# EAGLE design USBHost (EAGLE 6.5.0)
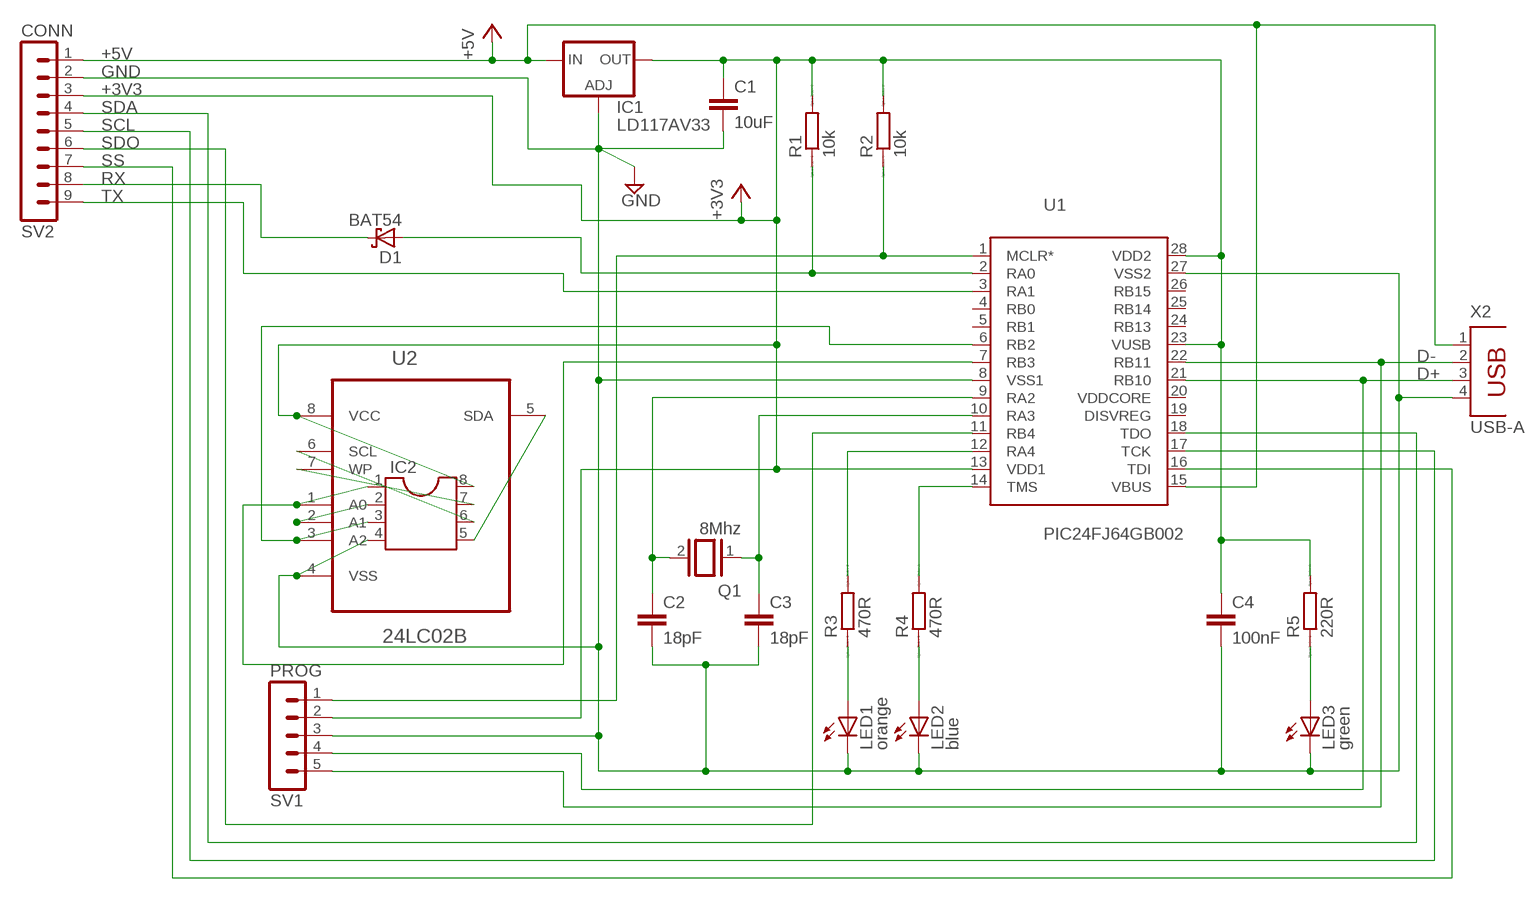
[diagram p0: schematic, sheet 1]

## Parts
C1  10uF  C-EU025-025X050  [C025-025X050]
C2  18pF  C-EU025-025X050  [C025-025X050]
C3  18pF  C-EU025-025X050  [C025-025X050]
C4  100nF  C-EU025-025X050  [C025-025X050]
D1  BAT54  SCHOTTKY-DIODEDO35-7  [DO35-7]
IC1  LD117AV33  [TO220L1]
IC2  DIL8S  [SOCKET-08]
LED1  orange  LED5MM  [LED5MM]
LED2  blue  LED5MM  [LED5MM]
LED3  green  LED5MM  [LED5MM]
Q1  8Mhz  XTAL/S  [QS]
R1  10k  R0204/7  [0204/7]
R2  10k  R0204/7  [0204/7]
R3  470R  R0204/7  [0204/7]
R4  470R  R0204/7  [0204/7]
R5  220R  R0204/7  [0204/7]
SV1  PROG  MA05-1  [MA05-1]
SV2  CONN  MA09-1  [MA09-1]
U1  PIC24FJ64GB002  PIC24FJ64GB002-I/SP  [DIP254P762X508-28]
U2  24LC02B  24LC02B-I/SN  [SOIC127P600X175-8N]
X2  USB-A  PN87520  [PN87520]

## Nets
+3V3: C1.1 C4.1 IC1.2(OUT) IC2.8 R1.2 R2.2 R5.2 SV1.2 SV2.3 U1.13(VDD1) U1.23(VUSB) U1.28(VDD2) U2.8(VCC)
+5V: IC1.3(IN) SV2.1 U1.15(VBUS) X2.1
D+: SV1.4 U1.21(RB10) X2.3
D-: SV1.5 U1.22(RB11) X2.2
GND: C1.2 C2.2 C3.2 C4.2 IC1.1(ADJ) IC2.4 LED1.K(C) LED2.K(C) LED3.K(C) SV1.3 SV2.2 U1.8(VSS1) U1.27(VSS2) U2.4(VSS) X2.4
N$1: C3.1 Q1.1 U1.10(RA3)
N$2: C2.1 Q1.2 U1.9(RA2)
N$4: LED3.A R5.1
N$5: R2.1 SV1.1 U1.1(MCLR*)
N$6: LED2.A R4.1
N$7: LED1.A R3.1
N$8: R4.2 U1.14(TMS)
N$9: R3.2 U1.12(RA4)
N$10: D1.A R1.1 U1.2(RA0)
N$11: IC2.2 U2.2(A1)
N$12: IC2.3 U1.6(RB2) U2.3(A2)
N$13: IC2.1 U1.7(RB3) U2.1(A0)
N$14: IC2.5 U2.5(SDA)
N$15: IC2.6 U2.6(SCL)
N$16: IC2.7 U2.7(WP)
RX: D1.C SV2.8
SCL: SV2.5 U1.17(TCK)
SDA: SV2.4 U1.18(TDO)
SDO: SV2.6 U1.11(RB4)
SS: SV2.7 U1.16(TDI)
TX: SV2.9 U1.3(RA1)
Unconnected: U1.4(RB0) U1.5(RB1) U1.19(DISVREG) U1.24(RB13) U1.25(RB14) U1.26(RB15)

## Power pins joined to a net without a drawn wire
VDDCORE: U1.20(VDDCORE)

## Library data of the parts
C1-C4 = resistor:C-EU: CAPACITOR, European symbol
D1 = diode:SCHOTTKY-DIODE: Schottky Diode
IC1 = v-reg:LD117A?*: Low drop fixed and adjustable positive voltage regulators 1 A Source: http://www.st.com/stonline/products/literature/ds/7194/ld1117axx.pdf
IC2 = ic-package:DIL8: Dual In Line / Socket
LED1-LED3 = led:LED: LED OSRAM: - CHIPLED LG R971, LG N971, LY N971, LG Q971, LY Q971, LO R971, LY R971 LH N974, LH R974 LS Q976, LO Q976, LY Q976 LO Q996 - Hyper CHIPLED LW Q18S LB Q993, LB Q99A, LB R99A - SideLED LS A670, LO A670, LY A670, LG A670, LP A670 LB A673, LV A673, LT A673, LW A673 LH A674 LY A675 LS A676, LA A676, LO A676, LY A676, LW A676 LS A679, LY A679, LG A679 - Hyper Micro SIDELED® LS Y876, LA Y876, LO Y876, LY Y876 LT Y87S - SmartLED LW L88C, LW L88S LB L89C, LB L89S, LG L890 LS L89K, LO L89K, LY L89K LS L896, LA L896, LO L896, LY L896 - TOPLED LS T670, LO T670, LY T670, LG T670, LP T670 LSG T670, LSP T670, LSY T670, LOP T670, LYG T670 LG T671, LOG T671, LSG T671 LB T673, LV T673, LT T673, LW T673 LH T674 LS T676, LA T676, LO T676, LY T676, LB T676, LH T676, LSB T676, LW T676 LB T67C, LV T67C, LT T67C, LS T67K, LO T67K, LY T67K, LW E67C LS E67B, LA E67B, LO E67B, LY E67B, LB E67C, LV E67C, LT E67C LW T67C LS T679, LY T679, LG T679 LS T770, LO T770, LY T770, LG T770, LP T770 LB T773, LV T773, LT T773, LW T773 LH T774 LS E675, LA E675, LY E675, LS T675 LS T776, LA T776, LO T776, LY T776, LB T776 LHGB T686 LT T68C, LB T68C - Hyper Mini TOPLED® LB M676 - Mini TOPLED Santana® LG M470 LS M47K, LO M47K, LY M47K Source: http://www.osram.convergy.de LUXEON: - LUMILED® LXK2-PW12-R00, LXK2-PW12-S00, LXK2-PW14-U00, LXK2-PW14-V00 LXK2-PM12-R00, LXK2-PM12-S00, LXK2-PM14-U00 LXK2-PE12-Q00, LXK2-PE12-R00, LXK2-PE12-S00, LXK2-PE14-T00, LXK2-PE14-U00 LXK2-PB12-K00, LXK2-PB12-L00, LXK2-PB12-M00, LXK2-PB14-N00, LXK2-PB14-P00, LXK2-PB14-Q00 LXK2-PR12-L00, LXK2-PR12-M00, LXK2-PR14-Q00, LXK2-PR14-R00 LXK2-PD12-Q00, LXK2-PD12-R00, LXK2-PD12-S00 LXK2-PH12-R00, LXK2-PH12-S00 LXK2-PL12-P00, LXK2-PL12-Q00, LXK2-PL12-R00 Source: www.luxeon.com KINGBRIGHT: KA-3528ASYC Source: www.kingbright.com
Q1 = special:XTAL/S: CRYSTAL
R1-R5 = eagle-ltspice:R: RESISTOR, European symbol; SPICEMODEL: NONE; SPICEPREFIX: R
SV1 = con-lstb:MA05-1: PIN HEADER; OC_FARNELL: unknown; OC_NEWARK: unknown
SV2 = con-lstb:MA09-1: PIN HEADER; OC_FARNELL: unknown; OC_NEWARK: unknown
U1 = Microchip-PIC24:PIC24FJ64GB002-I/SP: IC MCU 16BIT 64KB FLASH,SDIP-28; MPN: PIC24FJ64GB002-I/SP; OC_FARNELL: 07P9739; OC_NEWARK: 1778485; PACKAGE: DIP-28; SUPPLIER: Microchip
U2 = Microchip-24LCxxx:24LC: IC, I2C™ Serial EEPROM; MPN: 24LC02B-I/SNG; OC_FARNELL: 1818516; OC_NEWARK: 30H1482; PACKAGE: SOIC-8; SUPPLIER: MICROCHIP
X2 = con-berg_2:PN87520: BERG USB connector; OC_FARNELL: unknown; OC_NEWARK: unknown

## Net classes
0 default: clearance 0.205 mm

## Board
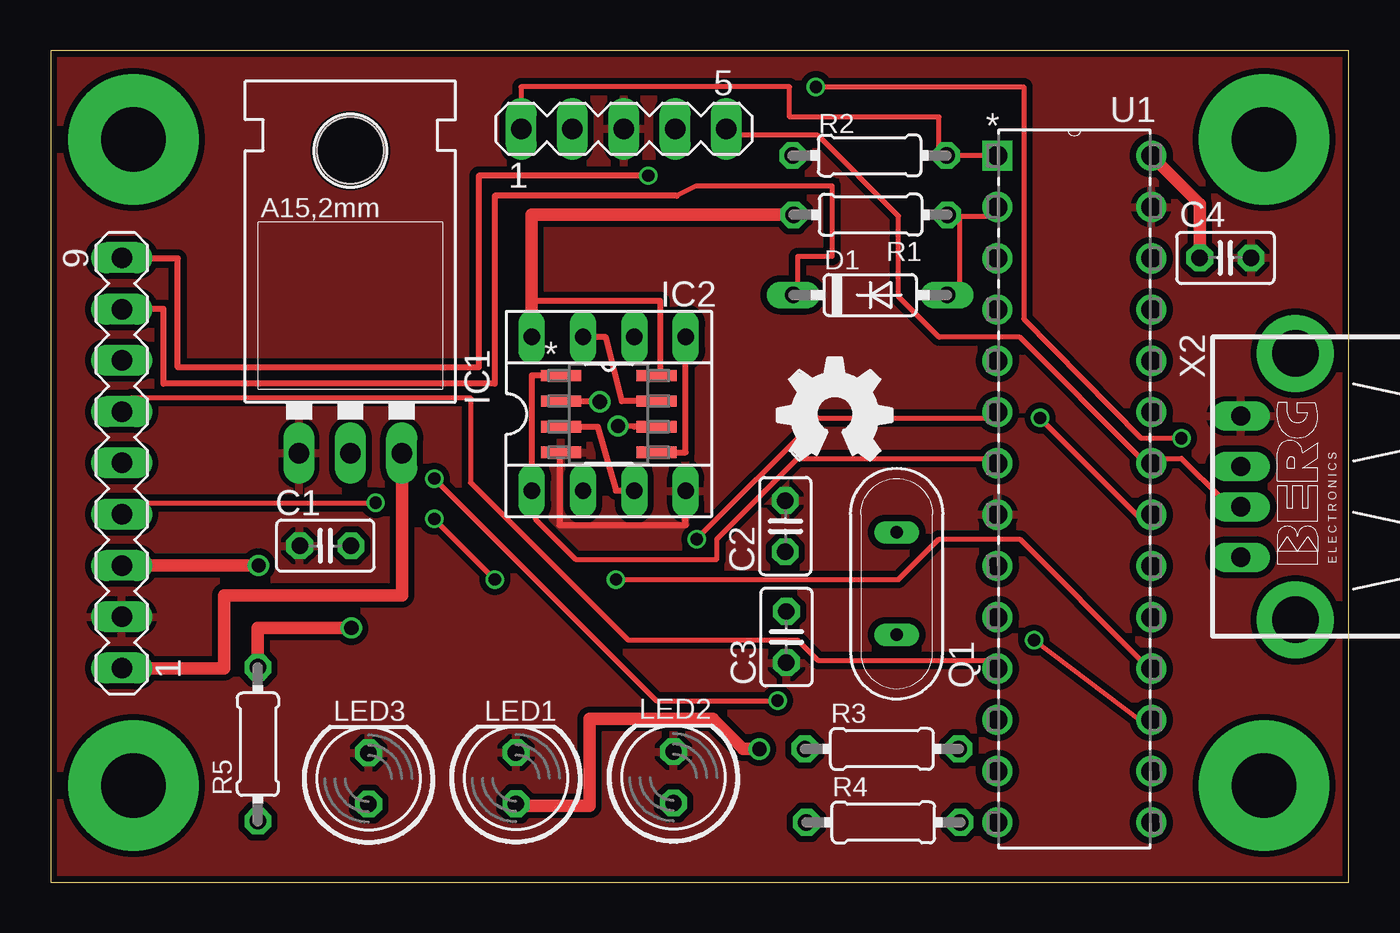
[diagram p1: board, top side]
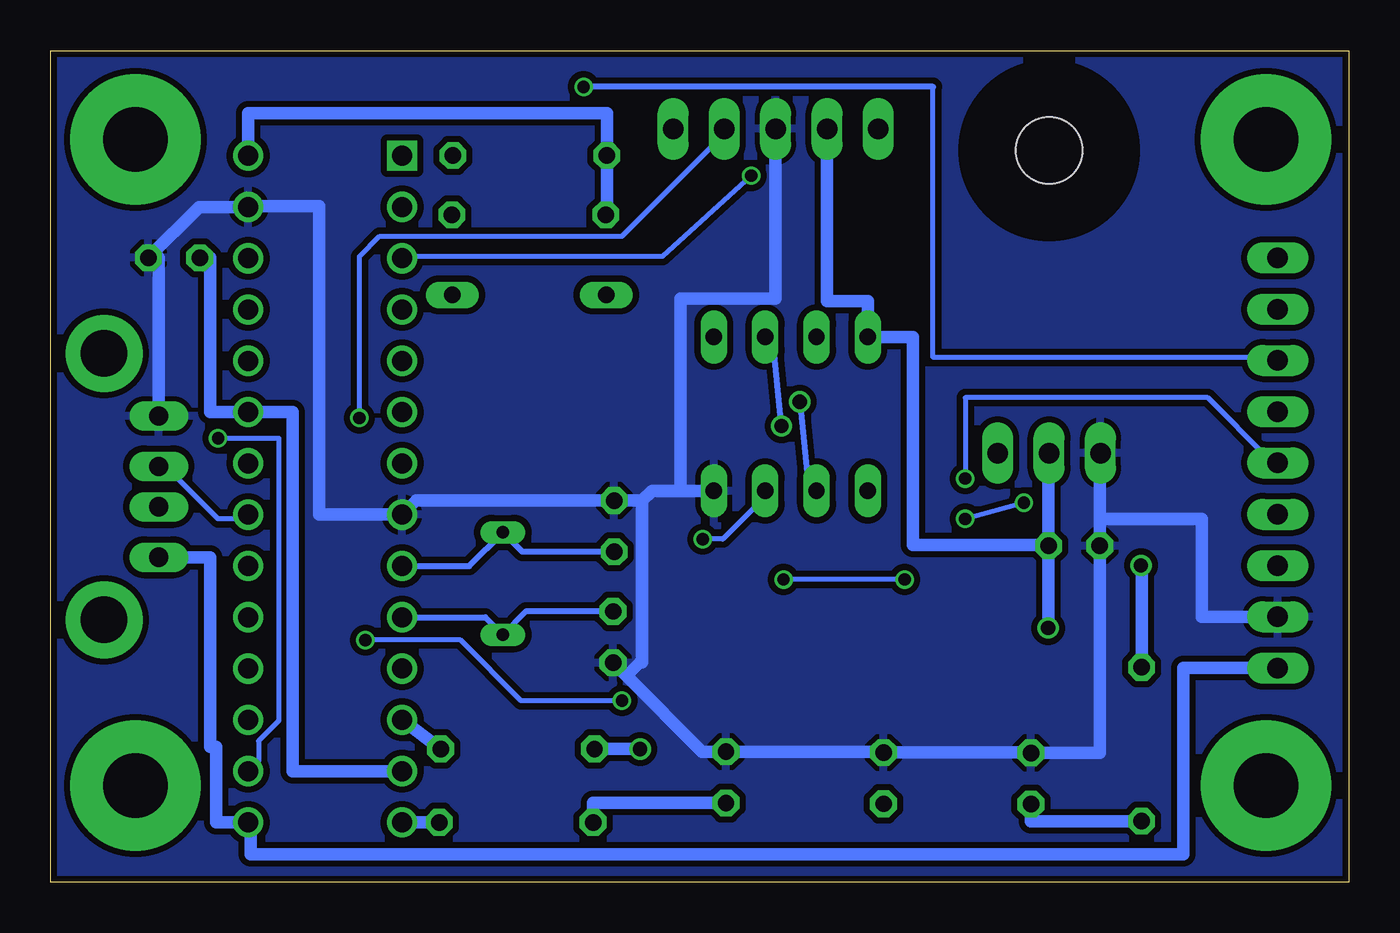
[diagram p2: board, bottom side, seen from below]

Size 64.3 x 41.2 mm. Coordinates in mm from the lower left corner, seen from the top.
Outline: 0,0 64.3,0 64.3,41.2 0,41.2 0,0
Copper layers (1*16): Top 0.035mm / dielectric 1.5mm / Bottom 0.035mm
Design rules "ITEADstudio_DRC": minimum track width 6mil, minimum drill 12mil, track to track 6mil, track to pad 6mil, pad to pad 6mil, via to via 6mil, smd to smd 0mil, copper to edge 10mil, drill to drill 10mil, minimum pad ring 10mil, minimum via ring 6mil, stop-mask expansion 2mil, vias tented up to drill 100mil, thermal gap 10mil

### Footprints (pad centres in the part's own frame; a part is rotated, then mirrored left to right if it is on the bottom)
C025-025X050 = drill 0.813 octagon: 1 -1.27,0; 2 1.27,0
DO35-7 = drill 0.813 long: A 3.81,0; C -3.81,0
TO220L1 = drill 1.016 long: 1 -2.54,-3.81; 2 0,-3.81; 3 2.54,-3.81 | hole 3.302: 0,11.176
SOCKET-08 = drill 0.813 long: 1 -3.81,-3.81; 2 -1.27,-3.81; 3 1.27,-3.81; 4 3.81,-3.81; 5 3.81,3.81; 6 1.27,3.81; 7 -1.27,3.81; 8 -3.81,3.81
LED5MM = drill 0.813 octagon: A -1.27,0; K 1.27,0
QS = drill 0.61 long: 1 -2.54,0; 2 2.54,0
0204/7 = drill 0.813 octagon: 1 -3.81,0; 2 3.81,0
MA05-1 = drill 1.016 long: 1 -5.08,0; 2 -2.54,0; 3 0,0; 4 2.54,0; 5 5.08,0
MA09-1 = drill 1.016 long: 1 -10.16,0; 2 -7.62,0; 3 -5.08,0; 4 -2.54,0; 5 0,0; 6 2.54,0; 7 5.08,0; 8 7.62,0; 9 10.16,0
DIP254P762X508-28 = drill 0.991 square: 1 -7.62,33.02 | drill 0.991: 2 -7.62,30.48; 3 -7.62,27.94; 4 -7.62,25.4; 5 -7.62,22.86; 6 -7.62,20.32; 7 -7.62,17.78; 8 -7.62,15.24; 9 -7.62,12.7; 10 -7.62,10.16; 11 -7.62,7.62; 12 -7.62,5.08; 13 -7.62,2.54; 14 -7.62,0; 15 0,0; 16 0,2.54; 17 0,5.08; 18 0,7.62; 19 0,10.16; 20 0,12.7; 21 0,15.24; 22 0,17.78; 23 0,20.32; 24 0,22.86; 25 0,25.4; 26 0,27.94; 27 0,30.48; 28 0,33.02
SOIC127P600X175-8N = smd 1.981 x 0.559: 1 -2.362,1.905; 2 -2.362,0.635; 3 -2.362,-0.635; 4 -2.362,-1.905; 5 2.362,-1.905; 6 2.362,-0.635; 7 2.362,0.635; 8 2.362,1.905
PN87520 = drill 0.95 long: 1 -3.5,2.71; 2 -1,2.71; 3 1,2.71; 4 3.5,2.71 | drill 2.3 pad 3.81: P$1 -6.6,0; P$2 6.6,0

### Placement (x,y rotation side)
C1  13.61,16.67 180 top
C2  36.39,17.64 90 top
C3  36.44,12.15 270 top
C4  58.18,30.93 0 top
D1  40.59,29.09 0 top
IC1  14.85,25.07 0 top
IC2  27.64,23.2 0 top
LED1  23.05,5.16 90 top
LED2  30.85,5.2 90 top
LED3  15.75,5.14 90 top
Q1  41.9,14.8 90 top
R1  40.61,33.06 180 top
R2  40.56,36 180 top
R3  41.17,6.61 0 top
R4  41.24,2.97 0 top
R5  10.27,6.84 90 top
SV1  28.39,37.32 0 top
SV2  3.53,20.77 90 top
U1  54.51,2.97 0 top
U2  27.64,23.2 0 top
U$1  [OSHW_FILLX200_NOTEXT]  36,20.9 0 top
X2  61.65,19.6 90 top

### Tracks (layer width: path | path; a pad name or v marks a point on that pad's centre or on a via)
+3V3  (via drill 0.7)
  Top 0.305: U2.8 30.2,25.11 30.2,28.8 23.83,28.8 IC2.8
  Top 0.61: v14.9,12.6 10.27,12.6 R5.2 | C4.1 56.91,33.59 U1.28 | R1.2 23.83,33.06 IC2.8 | SV2.3 v10.3,15.69 v10.3,15.7
  Bottom 0.61: IC1.2 14.88,21.26 C1.1 | C1.1 14.88,16.7 21.6,16.7 21.6,27.01 IC2.8 23.83,28.8 25.85,28.8 SV1.2 | C1.1 14.88,12.6 v14.9,12.6 | R1.2 36.75,33.11 R2.2 36.75,38.1 54.51,38.1 U1.28 | C4.1 56.4,30.93 56.4,23.3 U1.23 52.3,23.29 52.3,5.5 U1.13 | v10.3,15.7 10.27,15.7 R5.2
+5V
  Top 0.61: IC1.3 17.4,14.2 8.6,14.2 8.6,10.6 SV2.1
  Bottom 0.61: X2.1 56.4,16.1 56.4,6.7 56.1,6.7 56.1,2.97 U1.15 54.4,2.97 54.4,1.4 8.2,1.4 8.2,10.61 SV2.1
D+  (via drill 0.61)
  Top 0.254: v49,23 54,18 U1.21
  Bottom 0.254: X2.3 58,20 56,18 55,18 U1.21 | v49,23 49,31 48,32 36,32 31,37 SV1.4
D-
  Top 0.254: X2.2 58,19 56,21 55,21 U1.22 54,21 48,27 44,27 42,29 42,33 38,37 34,37 SV1.5
GND
  Top 0.305: U2.4 25.2,21.3 25.2,17.7 31.45,17.7 IC2.4
  Bottom 0.61: IC1.1 12.34,21.26 12.34,18 | 12.34,18 C1.2 12.34,6.41 LED3.K 15.75,6.43 LED1.K 23.05,6.47 LED2.K 32.03,6.47 35.78,10.22 | SV2.2 7.3,13.15 7.3,18 12.34,18 | 35.78,10.22 C3.2 | 35,18.91 C2.2 46.19,18.91 U1.8 51,18.21 51,33.5 54.51,33.5 U1.27 56.93,33.45 C4.2 58.94,30.93 X2.4 | 35,18.91 35,10.9 35.1,10.9 35.78,10.22 | IC2.4 33.1,19.39 | 33.1,19.39 34.52,19.39 35,18.91 | SV1.3 28.4,28.9 33.1,28.9 33.1,19.39
  pour Bottom (isolate 0.305): 0.2,41 64.1,41.2 64.1,0.2 0.2,0.2
  pour Top (isolate 0.305): 0.2,41 64.1,41.2 64.1,0.2 0.2,0.2
N$1
  Bottom 0.305: U1.10 42.77,13.13 Q1.1 40.74,13.42 C3.1
N$2
  Bottom 0.305: U1.9 43.57,15.67 Q1.2 40.93,16.37 C2.1
N$4
  Bottom 0.61: R5.1 15.75,3.03 LED3.A
N$5
  Top 0.254: U1.1 47,36 R2.1 44,36 44,37.9 36.6,37.9 36.6,39.4 23.3,39.4 23.3,38.1 SV1.1
N$6
  Bottom 0.61: LED2.A 37.43,3.93 R4.1
N$7  (via drill 0.7)
  Top 0.61: v35.1,6.6 34.3,6.6 32.8,8.1 26.7,8.1 26.7,3.8 23.05,3.8 LED1.A
  Bottom 0.61: R3.1 v35.1,6.61 v35.1,6.6
N$8
  Bottom 0.61: R4.2 U1.14
N$9
  Bottom 0.61: R3.2 U1.12
N$10
  Top 0.254: 45,33 45,29 D1.A | 45,33 47,33 U1.2 | 45,33 R1.1
N$11  (via drill 0.7)
  Top 0.305: U2.2 26.66,23.84 v27.2,23.8
  Bottom 0.305: v27.2,23.8 26.8,19.82 IC2.2
N$12  (via drill 0.61)
  Top 0.254: v32,17 38,23 47,23 U1.6
  Top 0.305: U2.3 27.1,22.57 28,19.4 IC2.3
  Bottom 0.254: v32,17 31,17 29,19 IC2.3
N$13
  Top 0.254: U1.7 47,21 37,21 33,17 33,16 26,16 24,18 24,19 IC2.1
  Top 0.305: U2.1 23.83,25.11 IC2.1
N$14
  Top 0.305: U2.5 31.45,21.3 IC2.5
N$15  (via drill 0.7)
  Top 0.305: U2.6 28.9,22.57 v28.1,22.6
  Bottom 0.305: v28.1,22.6 28.5,26.6 IC2.6
N$16
  Top 0.305: U2.7 28.3,23.84 27.5,27 IC2.7
N$18  (via drill 3.2 pad 6.45)
  other vias: 4.1,36.8
N$19  (via drill 3.2 pad 6.45)
  other vias: 4.1,4.8
N$20  (via drill 3.2 pad 6.45)
  other vias: 60.1,4.8
N$21  (via drill 3.2 pad 6.45)
  other vias: 60.1,36.8
RX
  Top 0.254: 31,34 32,34.5 38.7,34.5 38.7,31 37,31 37,29 D1.C
  Top 0.305: 31,34 22,34 22,24.7 5.6,24.7 5.6,28.4 SV2.8
SCL  (via drill 0.61)
  Top 0.254: v48.7,12 54,8 U1.17 | v36,9 30,9 v19,20
  Bottom 0.254: v48.7,12 44,12 41,9 v36,9 | v19,20 19,24 7,24 4,21 SV2.5
SDA  (via drill 0.61)
  Top 0.254: v28,15 42,15 44,17 48,17 54,11 U1.18 | v19,18 v22,15 | v16.1,18.8 4.4,18.8 SV2.4
  Bottom 0.254: v22,15 v28,15 | v16.1,18.8 v19,18
SDO
  Top 0.254: U1.11 47,11 38,11 37,12 28.6,12 20.8,19.8 20.8,24 4,24 SV2.6
SS  (via drill 0.61)
  Top 0.254: v56,22 54,22 48.2,27.9 48.2,39.4 v37.9,39.4
  Bottom 0.254: v56,22 53,22 53,8 54,7 54,6 U1.16 | 20.6,39.4 20.6,26 4,26 SV2.7
  Bottom 0.305: 20.6,39.4 v37.9,39.4
TX  (via drill 0.61)
  Top 0.305: v29.6,35 21.2,35 21.2,25.5 6.3,25.5 6.3,30.9 3.53,30.9 SV2.9
  Bottom 0.254: v29.6,35 34,31 47,31 U1.3

### Text on the board
Document: D+ | D- | 3V3 | GND | TX | MCLR | RX | SS | SDO | SCL | SDA | 3V3 | GND | 5V
tDocu: [noti, 2014] | USB Host Board
bDocu: Thanks, / hobbytronics.co.uk